# EAGLE design Rev 1 (EAGLE 5.11)
OC_FARNELL: unknown
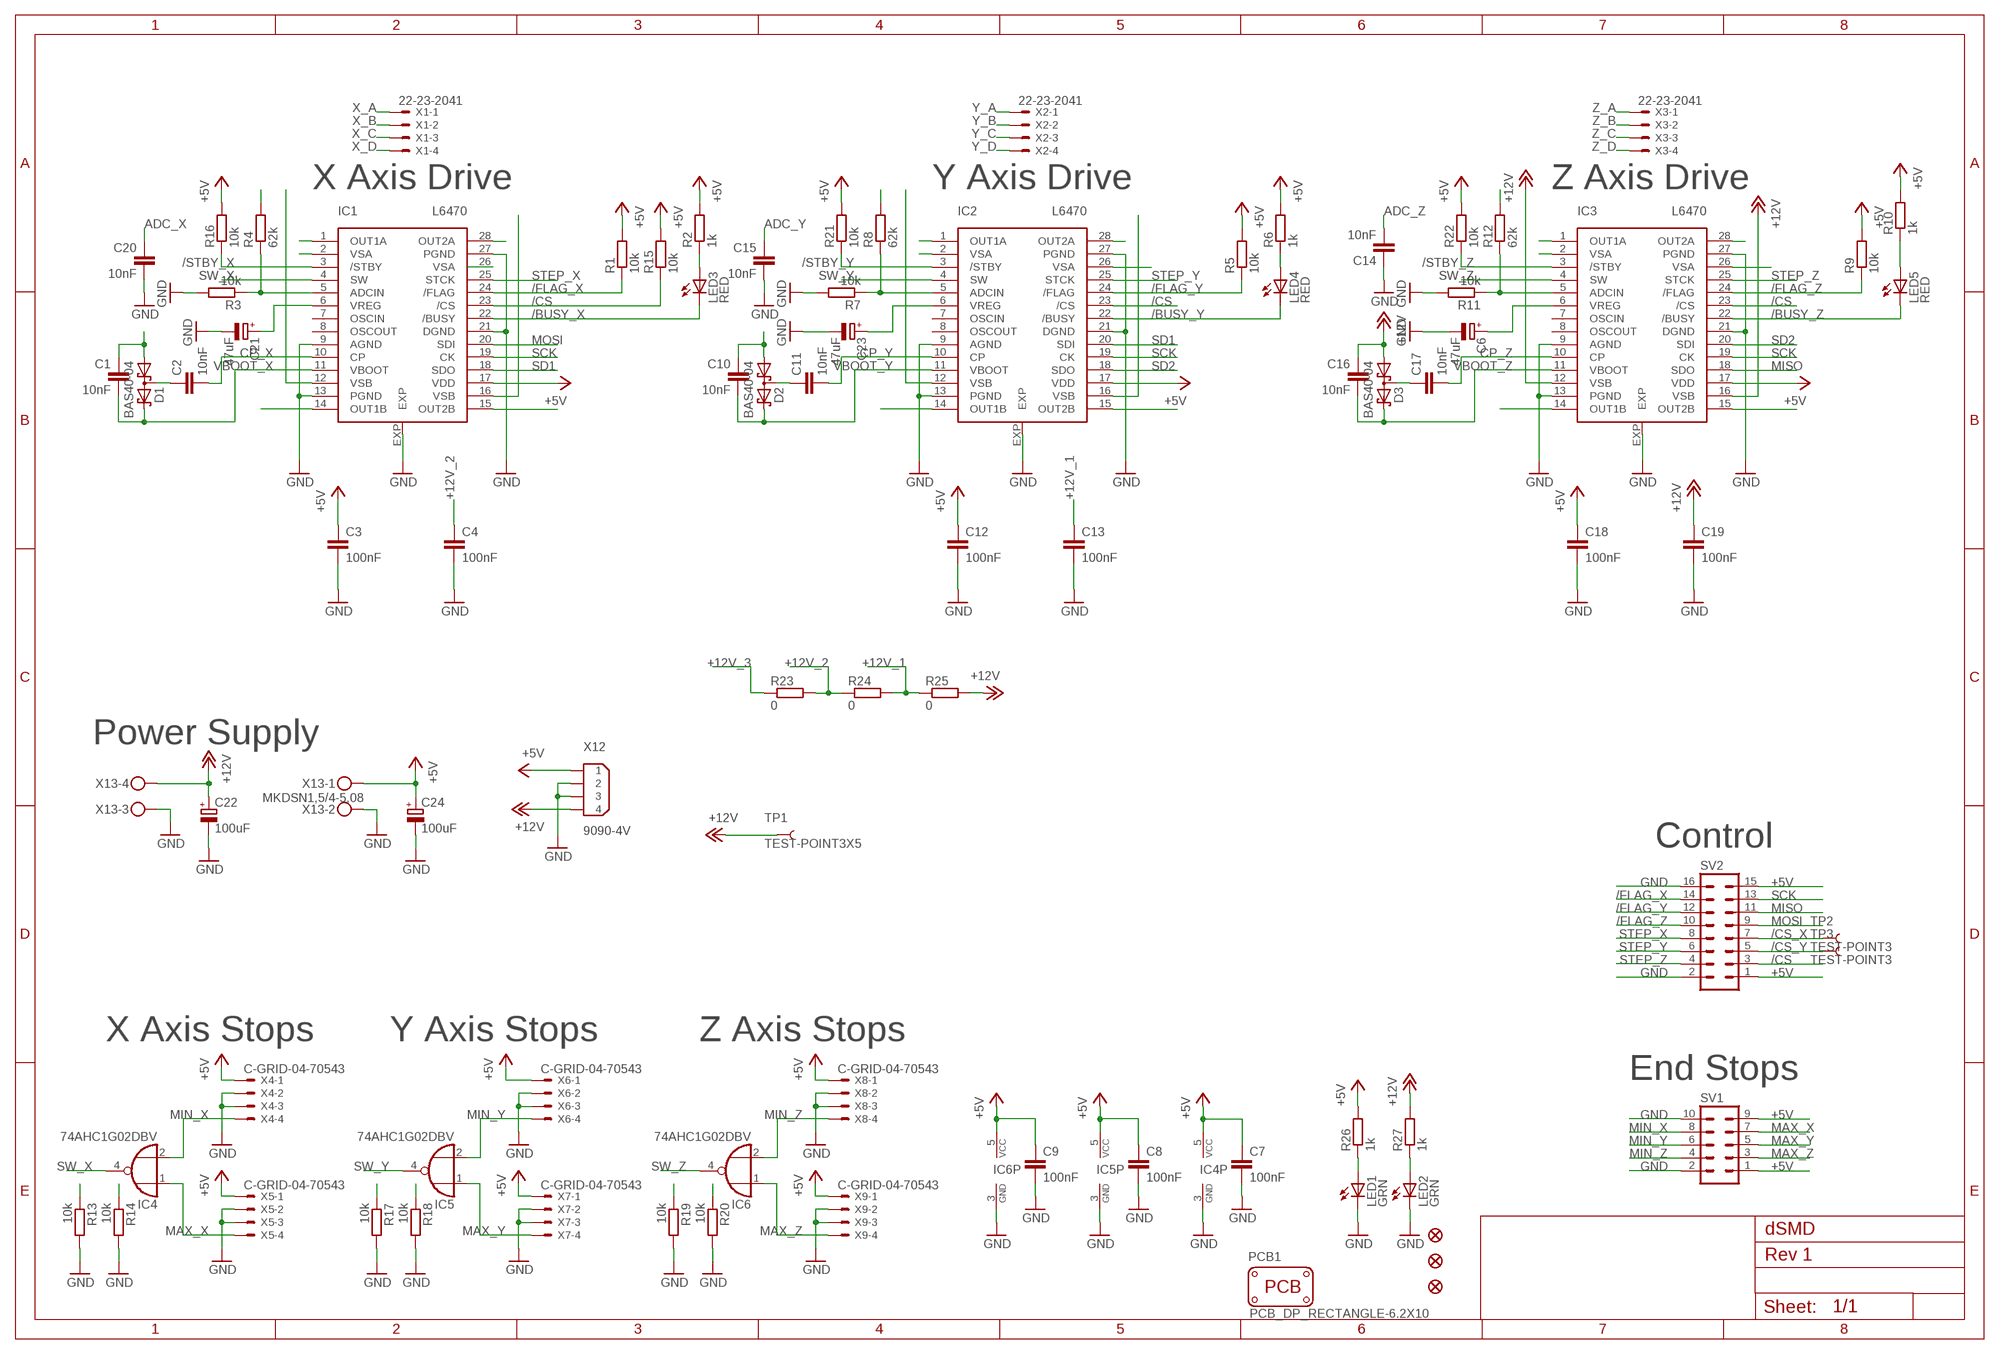
[diagram p0: schematic, sheet 1]

## Parts
C1  10nF  C-EUC0603  [C0603]
C2  10nF  C-EUC0603  [C0603]
C3  100nF  C-EUC0603  [C0603]
C4  100nF  C-EUC0603  [C0603]
C6  47uF  CPOL-EUB  [PANASONIC_B]
C7  100nF  C-EUC0603  [C0603]
C8  100nF  C-EUC0603  [C0603]
C9  100nF  C-EUC0603  [C0603]
C10  10nF  C-EUC0603  [C0603]
C11  10nF  C-EUC0603  [C0603]
C12  100nF  C-EUC0603  [C0603]
C13  100nF  C-EUC0603  [C0603]
C14  10nF  C-EUC0603  [C0603]
C15  10nF  C-EUC0603  [C0603]
C16  10nF  C-EUC0603  [C0603]
C17  10nF  C-EUC0603  [C0603]
C18  100nF  C-EUC0603  [C0603]
C19  100nF  C-EUC0603  [C0603]
C20  10nF  C-EUC0603  [C0603]
C21  47uF  CPOL-EUB  [PANASONIC_B]
C22  100uF  CPOL-EUE  [PANASONIC_E]
C23  47uF  CPOL-EUB  [PANASONIC_B]
C24  100uF  CPOL-EUE  [PANASONIC_E]
D1  BAS40-04  [SOT23]
D2  BAS40-04  [SOT23]
D3  BAS40-04  [SOT23]
FID1  FIDUCIAL1X2.5  [FIDUCIAL-1X2.5]
FID2  FIDUCIAL1X2.5  [FIDUCIAL-1X2.5]
FID3  FIDUCIAL1X2.5  [FIDUCIAL-1X2.5]
IC1  L6470  [TSSOP28]
IC2  L6470  [TSSOP28]
IC3  L6470  [TSSOP28]
IC4  74AHC1G02DBV  [SOT23-5]
IC5  74AHC1G02DBV  [SOT23-5]
IC6  74AHC1G02DBV  [SOT23-5]
LED1  GRN  LEDCHIP-LED0603  [CHIP-LED0603]
LED2  GRN  LEDCHIP-LED0603  [CHIP-LED0603]
LED3  RED  LEDCHIP-LED0603  [CHIP-LED0603]
LED4  RED  LEDCHIP-LED0603  [CHIP-LED0603]
LED5  RED  LEDCHIP-LED0603  [CHIP-LED0603]
PCB1  PCB_DP_RECTANGLE-6.2X10  [DP10062_V1]
R1  10k  R-EU_R0603  [R0603]
R2  1k  R-EU_R0603  [R0603]
R3  10k  R-EU_R0603  [R0603]
R4  62k  R-EU_R0603  [R0603]
R5  10k  R-EU_R0603  [R0603]
R6  1k  R-EU_R0603  [R0603]
R7  10k  R-EU_R0603  [R0603]
R8  62k  R-EU_R0603  [R0603]
R9  10k  R-EU_R0603  [R0603]
R10  1k  R-EU_R0603  [R0603]
R11  10k  R-EU_R0603  [R0603]
R12  62k  R-EU_R0603  [R0603]
R13  10k  R-EU_R0603  [R0603]
R14  10k  R-EU_R0603  [R0603]
R15  10k  R-EU_R0603  [R0603]
R16  10k  R-EU_R0603  [R0603]
R17  10k  R-EU_R0603  [R0603]
R18  10k  R-EU_R0603  [R0603]
R19  10k  R-EU_R0603  [R0603]
R20  10k  R-EU_R0603  [R0603]
R21  10k  R-EU_R0603  [R0603]
R22  10k  R-EU_R0603  [R0603]
R23  0  R-EU_0204/7  [0204/7]
R24  0  R-EU_0204/7  [0204/7]
R25  0  R-EU_0204/7  [0204/7]
R26  1k  R-EU_R0603  [R0603]
R27  1k  R-EU_R0603  [R0603]
SV1  ML10  [ML10]
SV2  ML16  [ML16]
TP1  TEST-POINT3X5  [PAD.03X.05]
TP2  TEST-POINT3  [PAD.03X.03]
TP3  TEST-POINT3  [PAD.03X.03]
X1  22-23-2041  [22-23-2041]
X2  22-23-2041  [22-23-2041]
X3  22-23-2041  [22-23-2041]
X4  C-GRID-04-70543  [70543-04]
X5  C-GRID-04-70543  [70543-04]
X6  C-GRID-04-70543  [70543-04]
X7  C-GRID-04-70543  [70543-04]
X8  C-GRID-04-70543  [70543-04]
X9  C-GRID-04-70543  [70543-04]
X12  9090-4V  [9090-4V]
X13  MKDSN1,5/4-5,08  [MKDSN1,5/4-5,08]

## Nets
+5V [5_V]: C3.1 C7.1 C8.1 C9.1 C12.1 C18.1 C24.+ IC1.17(VDD) IC2.17(VDD) IC3.17(VDD) IC4.5(VCC) IC5.5(VCC) IC6.5(VCC) R1.2 R2.2 R5.2 R6.2 R9.2 R10.2 R15.2 R16.2 R21.2 R22.2 R26.2 SV1.1 SV1.9 SV2.1 SV2.15 X4.1 X5.1 X6.1 X7.1 X8.1 X9.1 X12.1 X13.1
+12V [12_V]: C16.1 C19.1 C22.+ D3.1(A1) IC3.12(VSB) IC3.16(VSB) R25.2 R27.2 TP1.P$1 X12.4 X13.4
+12V_1 [12_V]: C10.1 C13.1 D2.1(A1) IC2.12(VSB) IC2.16(VSB) IC3.2(VSA) IC3.26(VSA) R12.2 R24.2 R25.1
+12V_2: C1.1 C4.1 D1.1(A1) IC1.12(VSB) IC1.16(VSB) IC2.2(VSA) IC2.26(VSA) R8.2 R23.2 R24.1
+12V_3: IC1.2(VSA) IC1.26(VSA) R4.2 R23.1
/BUSY_X: IC1.22(/BUSY) LED3.C
/BUSY_Y: IC2.22(/BUSY) LED4.C
/BUSY_Z: IC3.22(/BUSY) LED5.C
/CS: IC1.23(/CS) IC2.23(/CS) IC3.23(/CS) R15.1 SV2.3
/CS_X: SV2.7 TP2.P$1
/CS_Y: SV2.5 TP3.P$1
/FLAG_X: IC1.24(/FLAG) R1.1 SV2.14
/FLAG_Y: IC2.24(/FLAG) R5.1 SV2.12
/FLAG_Z: IC3.24(/FLAG) R9.1 SV2.10
/STBY_X: IC1.3(/STBY) R16.1
/STBY_Y: IC2.3(/STBY) R21.1
/STBY_Z: IC3.3(/STBY) R22.1
ADC_X: C20.1 IC1.5(ADCIN) R3.1 R4.1
ADC_Y: C15.1 IC2.5(ADCIN) R7.1 R8.1
ADC_Z: C14.2 IC3.5(ADCIN) R11.1 R12.1
CP_X: C2.2 IC1.10(CP)
CP_Y: C11.2 IC2.10(CP)
CP_Z: C17.2 IC3.10(CP)
GND: C3.2 C4.2 C6.- C7.2 C8.2 C9.2 C12.2 C13.2 C14.1 C15.2 C18.2 C19.2 C20.2 C21.- C22.- C23.- C24.- IC1.9(AGND) IC1.13(PGND) IC1.21(DGND) IC1.27(PGND) IC1.EXP IC2.9(AGND) IC2.13(PGND) IC2.21(DGND) IC2.27(PGND) IC2.EXP IC3.9(AGND) IC3.13(PGND) IC3.21(DGND) IC3.27(PGND) IC3.EXP IC4.3(GND) IC5.3(GND) IC6.3(GND) LED1.C LED2.C R3.2 R7.2 R11.2 R13.2 R14.2 R17.2 R18.2 R19.2 R20.2 SV1.2 SV1.10 SV2.2 SV2.16 X4.2 X4.3 X5.2 X5.3 X6.2 X6.3 X7.2 X7.3 X8.2 X8.3 X9.2 X9.3 X12.2 X12.3 X13.2 X13.3
MAX_X: IC4.1(I0) R14.1 SV1.7 X5.4
MAX_Y: IC5.1(I0) R18.1 SV1.5 X7.4
MAX_Z: IC6.1(I0) R20.1 SV1.3 X9.4
MIN_X: IC4.2(I1) R13.1 SV1.8 X4.4
MIN_Y: IC5.2(I1) R17.1 SV1.6 X6.4
MIN_Z: IC6.2(I1) R19.1 SV1.4 X8.4
MISO: IC3.18(SDO) SV2.11
MOSI: IC1.20(SDI) SV2.9
N$1: C17.1 D3.3(C1A2)
N$3: C2.1 D1.3(C1A2)
N$10: C21.+ IC1.6(VREG)
N$15: C11.1 D2.3(C1A2)
N$17: LED1.A R26.1
N$18: LED2.A R27.1
N$22: LED3.A R2.1
N$23: LED4.A R6.1
N$26: LED5.A R10.1
N$27: C6.+ IC3.6(VREG)
N$29: C23.+ IC2.6(VREG)
SCK: IC1.19(CK) IC2.19(CK) IC3.19(CK) SV2.13
SD1: IC1.18(SDO) IC2.20(SDI)
SD2: IC2.18(SDO) IC3.20(SDI)
STEP_X: IC1.25(STCK) SV2.8
STEP_Y: IC2.25(STCK) SV2.6
STEP_Z: IC3.25(STCK) SV2.4
SW_X: IC1.4(SW) IC4.4(O)
SW_Y: IC2.4(SW) IC5.4(O)
SW_Z: IC3.4(SW) IC6.4(O)
VBOOT_X: C1.2 D1.2(C2) IC1.11(VBOOT)
VBOOT_Y: C10.2 D2.2(C2) IC2.11(VBOOT)
VBOOT_Z: C16.2 D3.2(C2) IC3.11(VBOOT)
X_A [12_V]: IC1.14(OUT1B) X1.1
X_B [12_V]: IC1.15(OUT2B) X1.2
X_C [12_V]: IC1.28(OUT2A) X1.3
X_D [12_V]: IC1.1(OUT1A) X1.4
Y_A [12_V]: IC2.14(OUT1B) X2.1
Y_B [12_V]: IC2.15(OUT2B) X2.2
Y_C [12_V]: IC2.28(OUT2A) X2.3
Y_D [12_V]: IC2.1(OUT1A) X2.4
Z_A: IC3.14(OUT1B) X3.1
Z_B: IC3.15(OUT2B) X3.2
Z_C: IC3.28(OUT2A) X3.3
Z_D: IC3.1(OUT1A) X3.4
Unconnected: IC1.7(OSCIN) IC1.8(OSCOUT) IC2.7(OSCIN) IC2.8(OSCOUT) IC3.7(OSCIN) IC3.8(OSCOUT)

## Notes on the sheet
- X Axis Drive | Y Axis Drive | Z Axis Drive
- Power Supply
- Control
- X Axis Stops | Y Axis Stops | Z Axis Stops
- End Stops
- dSMD

## Library data of the parts
C1-C4 C7-C20 = rcl:C-EU: CAPACITOR, European symbol
C6 C21-C24 = rcl:CPOL-EU: POLARIZED CAPACITOR, European symbol
D1-D3 = diode:BAS40-04: Silicon Schottky Diodes General-purpose diode for high-speed switching
FID1-FID3 = microbuilder:FIDUCIAL: Fiducial Alignment Points Various fiducial points for machine vision alignment.
IC1-IC3 = general:L6470: The L6470, realized in analog mixed signal technology, is an advanced fully integrated solution suitable for driving two phase bipolar stepper motors with microstepping. It integrates a dual low RDSon DMOS full bridge with all of the power switches equipped with an accurate on chip current sensing circuitry suitable for non dissipative current control and overcurrent protections. Thanks to a unique control system a true 1/128 steps resolution is achieved. The digital control core can generate user defined motion profiles with acceleration, deceleration, speed or target position easily programmed through a dedicated registers set. All commands and data registers, including those used to set analogue values (i.e. current control value, current protection trip point, dead time, PWM frequency etc.) are sent through a standard 5Mbit/s SPI. A very rich set of protections (thermal, low bus voltage, overcurrent, motor stall) allows designing a fully protected application, as required by most demanding motor control applications.
IC4-IC6 = 74xx-little-de:74*1G02: 2-input NOR gate
LED1-LED5 = led:LED: LED OSRAM: - CHIPLED LG R971, LG N971, LY N971, LG Q971, LY Q971, LO R971, LY R971 LH N974, LH R974 LS Q976, LO Q976, LY Q976 LO Q996 - Hyper CHIPLED LW Q18S LB Q993, LB Q99A, LB R99A - SideLED LS A670, LO A670, LY A670, LG A670, LP A670 LB A673, LV A673, LT A673, LW A673 LH A674 LY A675 LS A676, LA A676, LO A676, LY A676, LW A676 LS A679, LY A679, LG A679 - Hyper Micro SIDELED® LS Y876, LA Y876, LO Y876, LY Y876 LT Y87S - SmartLED LW L88C, LW L88S LB L89C, LB L89S, LG L890 LS L89K, LO L89K, LY L89K LS L896, LA L896, LO L896, LY L896 - TOPLED LS T670, LO T670, LY T670, LG T670, LP T670 LSG T670, LSP T670, LSY T670, LOP T670, LYG T670 LG T671, LOG T671, LSG T671 LB T673, LV T673, LT T673, LW T673 LH T674 LS T676, LA T676, LO T676, LY T676, LB T676, LH T676, LSB T676, LW T676 LB T67C, LV T67C, LT T67C, LS T67K, LO T67K, LY T67K, LW E67C LS E67B, LA E67B, LO E67B, LY E67B, LB E67C, LV E67C, LT E67C LW T67C LS T679, LY T679, LG T679 LS T770, LO T770, LY T770, LG T770, LP T770 LB T773, LV T773, LT T773, LW T773 LH T774 LS E675, LA E675, LY E675, LS T675 LS T776, LA T776, LO T776, LY T776, LB T776 LHGB T686 LT T68C, LB T68C - Hyper Mini TOPLED® LB M676 - Mini TOPLED Santana® LG M470 LS M47K, LO M47K, LY M47K Source: http://www.osram.convergy.de LUXEON: - LUMILED® LXK2-PW12-R00, LXK2-PW12-S00, LXK2-PW14-U00, LXK2-PW14-V00 LXK2-PM12-R00, LXK2-PM12-S00, LXK2-PM14-U00 LXK2-PE12-Q00, LXK2-PE12-R00, LXK2-PE12-S00, LXK2-PE14-T00, LXK2-PE14-U00 LXK2-PB12-K00, LXK2-PB12-L00, LXK2-PB12-M00, LXK2-PB14-N00, LXK2-PB14-P00, LXK2-PB14-Q00 LXK2-PR12-L00, LXK2-PR12-M00, LXK2-PR14-Q00, LXK2-PR14-R00 LXK2-PD12-Q00, LXK2-PD12-R00, LXK2-PD12-S00 LXK2-PH12-R00, LXK2-PH12-S00 LXK2-PL12-P00, LXK2-PL12-Q00, LXK2-PL12-R00 Source: www.luxeon.com KINGBRIGHT: KA-3528ASYC Source: www.kingbright.com
PCB1 = dp_devices:PCB_DP_RECTANGLE: Dangerous Prototypes Standard Rectangular PCB sizes
R1-R27 = rcl:R-EU_: RESISTOR, European symbol
SV1 = con-harting-ml:ML10: HARTING
SV2 = con-ml:ML16: HARTING
TP1-TP3 = SparkFun:TEST-POINT
X1-X3 = con-molex:22-23-2041: .100" (2.54mm) Center Header - 4 Pin
X4-X9 = con-molex:C-GRID-04: CONNECTOR wire to board 2.54 mm (0.100") pitch header
X12 = con-thomas-betts:9090-4: Disk Drive Power four position Source: Thomas & Betts Electronic Interconnects Eiropean Edition 1998
X13 = con-phoenix-508:MKDSN1,5/4-5,08: MKDSN 1,5/ 4-5,08 Printklemme Nennstrom: 13,5 A Nennspannung: 250 V Rastermaß: 5,08 mm Polzahl: 4 Anschlussart: Schraubanschluss Montage: Löten Anschlussrichtung Leiter/Platine: 0 ° Artikelnummer: 1729144 Source: http://eshop.phoenixcontact.com .. 1729144.pdf

## Net classes
0 default: drill 0.33 mm, clearance 0.203 mm
1 12_V: width 0.406 mm, drill 0.33 mm, clearance 0.203 mm
2 5_V: width 0.305 mm, drill 0.33 mm, clearance 0.203 mm

## Board
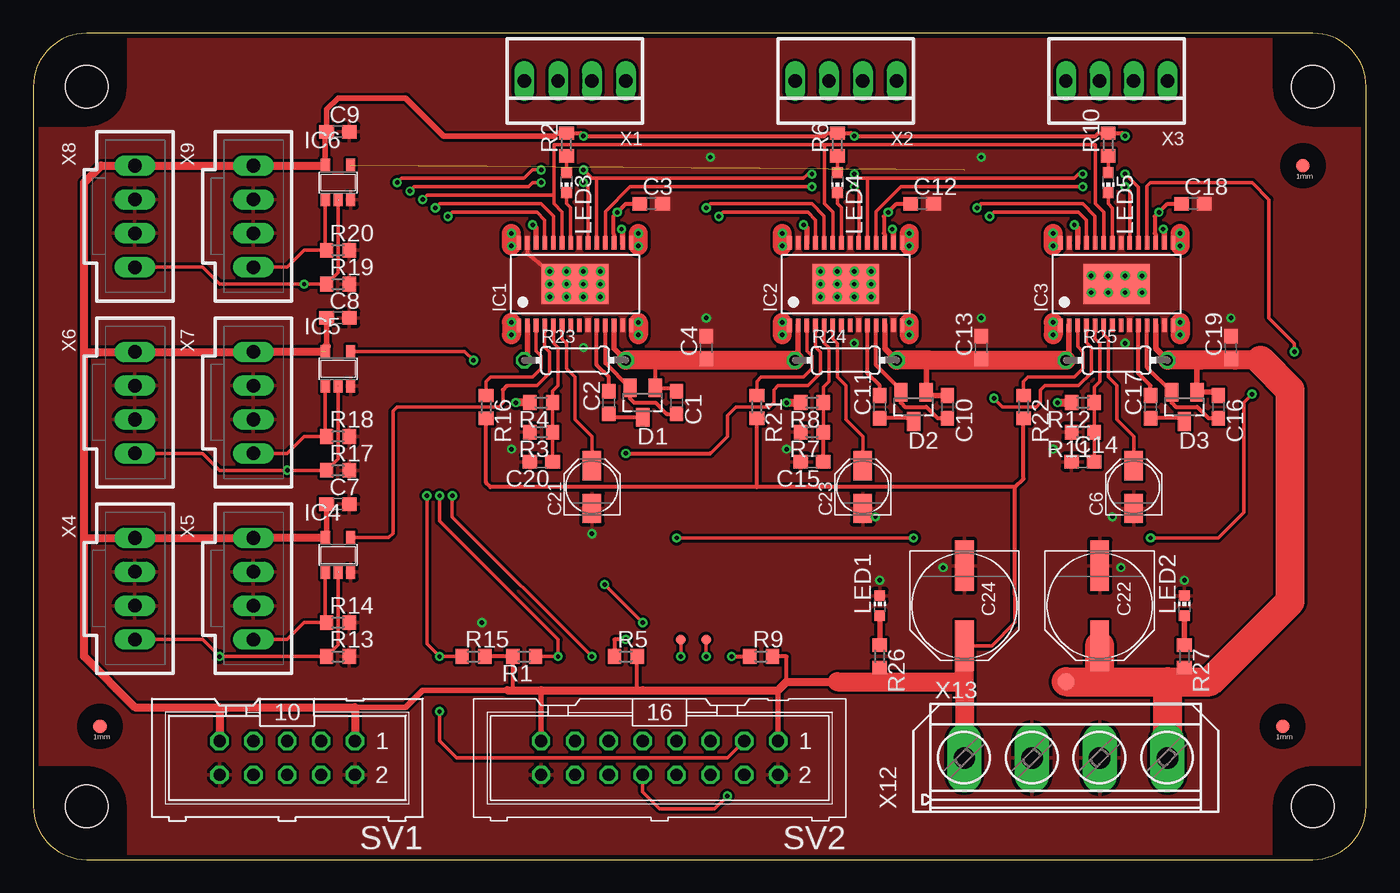
[diagram p1: board, top side]
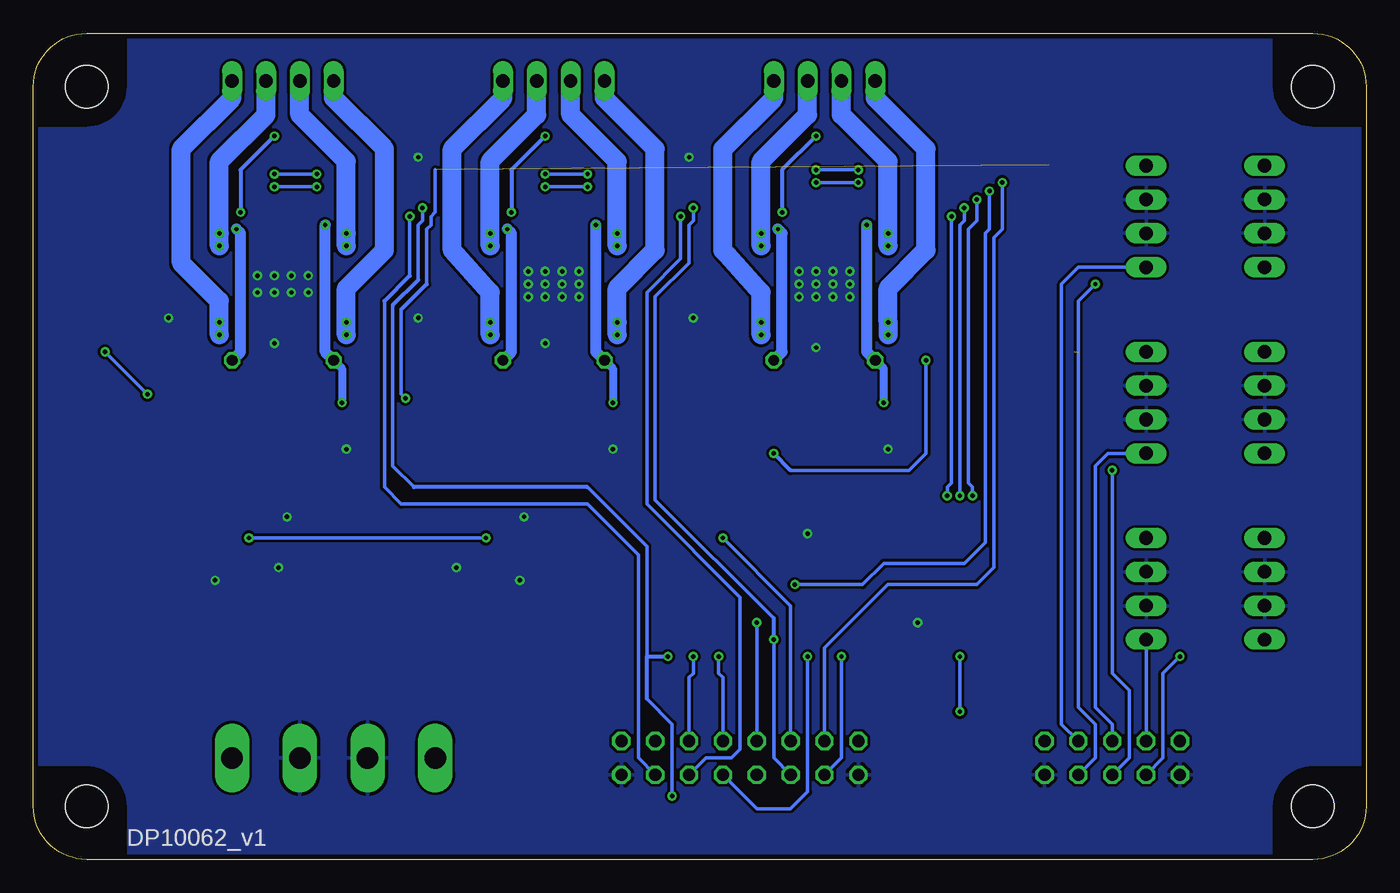
[diagram p2: board, bottom side, seen from below]

Size 100 x 62 mm. Coordinates in mm from the lower left corner, seen from the top.
Copper layers (1*16): Top 0.0356mm / dielectric 1.5011mm / Bottom 0.0356mm
Design rules "LaenPCBOrder": minimum track width 6mil, minimum drill 13mil, track to track 6mil, track to pad 6mil, pad to pad 6mil, via to via 6mil, smd to smd 6mil, copper to edge 15mil, drill to drill 6mil, minimum pad ring 7mil, minimum via ring 7mil, stop-mask expansion 4mil, vias tented up to drill 0mil, thermal gap 10mil

### Footprints (pad centres in the part's own frame; a part is rotated, then mirrored left to right if it is on the bottom)
C0603 = smd 1.1 x 1: 1 -0.85,0; 2 0.85,0
PANASONIC_B = smd 2.2 x 1.4: + 1.6,0; - -1.6,0
PANASONIC_E = smd 3.8 x 1.4: + 3,0; - -3,0
SOT23 = smd 1 x 1.4: 1 -0.95,-1.1; 2 0.95,-1.1; 3 0,1.1
FIDUCIAL-1X2.5 = smd 1 x 1: 1 0,0
TSSOP28 = smd 0.35 x 1: 1 -4.225,-3.087; 2 -3.575,-3.087; 3 -2.925,-3.087; 4 -2.275,-3.087; 5 -1.625,-3.087; 6 -0.975,-3.087; 7 -0.325,-3.087; 8 0.325,-3.087; 9 0.975,-3.087; 10 1.625,-3.087; 11 2.275,-3.087; 12 2.925,-3.087; 13 3.575,-3.087; 14 4.225,-3.087; 15 4.225,3.087; 16 3.575,3.087; 17 2.925,3.087; 18 2.275,3.087; 19 1.625,3.087; 20 0.975,3.087; 21 0.325,3.087; 22 -0.325,3.087; 23 -0.975,3.087; 24 -1.625,3.087; 25 -2.275,3.087; 26 -2.925,3.087; 27 -3.575,3.087; 28 -4.225,3.087 | smd 5 x 3: EXP 0,0
SOT23-5 = smd 0.69 x 0.99: 1 -0.95,-1.29; 2 0,-1.29; 3 0.95,-1.29; 4 0.95,1.3; 5 -0.95,1.3
CHIP-LED0603 = smd 0.8 x 0.8: A 0,-0.75; C 0,0.75
DP10062_V1 = hole 3.2: 4,4; 96,4; 96,58; 4,58
R0603 = smd 1 x 1.1: 1 -0.85,0; 2 0.85,0
0204/7 = drill 0.813 octagon: 1 -3.81,0; 2 3.81,0
ML10 = drill 0.914 octagon: 1 -5.08,-1.27; 2 -5.08,1.27; 3 -2.54,-1.27; 4 -2.54,1.27; 5 0,-1.27; 6 0,1.27; 7 2.54,-1.27; 8 2.54,1.27; 9 5.08,-1.27; 10 5.08,1.27
ML16 = drill 0.914 octagon: 1 -8.89,-1.27; 2 -8.89,1.27; 3 -6.35,-1.27; 4 -6.35,1.27; 5 -3.81,-1.27; 6 -3.81,1.27; 7 -1.27,-1.27; 8 -1.27,1.27; 9 1.27,-1.27; 10 1.27,1.27; 11 3.81,-1.27; 12 3.81,1.27; 13 6.35,-1.27; 14 6.35,1.27; 15 8.89,-1.27; 16 8.89,1.27
PAD.03X.05 = smd 1.27 x 1.27: P$1 0,0
PAD.03X.03 = smd 0.762 x 0.762: P$1 0,0
22-23-2041 = drill 1 long: 1 -3.81,0; 2 -1.27,0; 3 1.27,0; 4 3.81,0
70543-04 = drill 1.016 long: 1 -3.81,0; 2 -1.27,0; 3 1.27,0; 4 3.81,0
9090-4V = drill 1.6 pad 2.6 long: 1 -7.62,0; 2 -2.54,0; 3 2.54,0; 4 7.62,0
MKDSN1,5/4-5,08 = drill 1.3 pad 2 round: 1 -7.641,0.025; 2 -2.561,0.025; 3 2.519,0.025; 4 7.599,0.025

### Placement (x,y rotation side)
C1  48.26,34.29 270 top
C2  43.18,34.29 90 top
C3  46.35,49.21 0 top
C4  50.48,38.42 90 top
C6  82.55,27.94 90 top
C7  22.86,26.67 0 top
C8  22.86,40.64 0 top
C9  22.86,54.61 0 top
C10  68.58,33.97 270 top
C11  63.5,33.97 90 top
C12  66.67,49.21 0 top
C13  71.12,38.42 90 top
C14  78.74,29.84 0 top
C15  58.42,29.84 180 top
C16  88.9,33.97 270 top
C17  83.82,33.97 90 top
C18  87,49.21 0 top
C19  89.85,38.42 90 top
C20  38.1,29.84 180 top
C21  41.91,27.94 90 top
C22  80.01,19.05 270 top
C23  62.23,27.94 90 top
C24  69.85,19.05 270 top
D1  45.72,34.29 180 top
D2  66.04,33.97 180 top
D3  86.36,33.97 180 top
FID1  5,10 0 top
FID2  93.73,10 0 top
FID3  95.25,52.07 0 top
IC1  40.64,43.18 0 top
IC2  60.96,43.18 0 top
IC3  81.28,43.18 0 top
IC4  22.86,22.86 0 top
IC5  22.86,36.83 0 top
IC6  22.86,50.8 0 top
LED1  63.5,19.05 0 top
LED2  86.36,19.05 0 top
LED3  40.01,50.8 180 top
LED4  60.33,50.8 180 top
LED5  80.64,50.8 180 top
PCB1  0,0 0 top
R1  36.83,15.24 180 top
R2  40.01,53.66 90 top
R3  38.1,32.07 180 top
R4  38.1,34.29 180 top
R5  44.45,15.24 0 top
R6  60.33,53.66 90 top
R7  58.42,32.07 180 top
R8  58.42,34.29 180 top
R9  54.61,15.24 0 top
R10  80.64,53.66 90 top
R11  78.74,32.07 180 top
R12  78.74,34.29 180 top
R13  22.86,15.24 0 top
R14  22.86,17.78 0 top
R15  33.02,15.24 0 top
R16  33.97,33.97 270 top
R17  22.86,29.21 0 top
R18  22.86,31.75 0 top
R19  22.86,43.18 0 top
R20  22.86,45.72 0 top
R21  54.29,33.97 270 top
R22  74.3,33.97 270 top
R23  40.64,37.47 0 top
R24  60.96,37.47 0 top
R25  81.28,37.47 0 top
R26  63.5,15.24 270 top
R27  86.36,15.24 270 top
SV1  19.05,7.62 180 top
SV2  46.99,7.62 180 top
TP1  77.47,13.34 0 top
TP2  48.58,16.51 0 top
TP3  50.48,16.51 90 top
X1  40.64,58.42 180 top
X2  60.96,58.42 180 top
X3  81.28,58.42 180 top
X4  7.62,20.32 270 top
X5  16.51,20.32 270 top
X6  7.62,34.29 270 top
X7  16.51,34.29 270 top
X8  7.62,48.26 270 top
X9  16.51,48.26 270 top
X12  77.47,7.62 0 top
X13  77.47,7.62 0 top

### Tracks (layer width: path | path; a pad name or v marks a point on that pad's centre or on a via)
+5V  (via drill 0.33)  (1 unrouted)
  Top 0.254: C24.+ 71.93,16.05 73.66,17.78 73.66,19.86 | X5.1 16.54,24.16 | IC4.5 22.01,24.26
  Top 0.305: R16.2 33.97,28.26 34.29,27.94 54.29,27.94 | 54.29,27.94 R21.2 | R22.2 74.3,28.57 73.66,27.94 | 73.66,27.94 54.29,27.94 | IC1.17 43.56,46.92 43.5,46.99 43.5,48.26 v43.81,48.58 44.45,49.21 C3.1 | IC2.17 63.88,46.92 63.82,46.99 63.82,48.26 v64.14,48.58 64.77,49.21 C12.1 | IC3.17 84.2,46.92 84.14,46.99 84.14,48.26 v84.45,48.58 85.09,49.21 C18.1 | 73.66,19.86 73.66,27.94 | 35.56,12.7 35.98,12.7 R1.2 R15.2 | R5.2 45.3,12.7 45.72,12.7 | R9.2 56.52,15.24 56.52,13.34 | R2.2 41.06,54.51 v41.27,54.29 59.37,54.29 59.59,54.51 R6.2 61.38,54.51 v61.59,54.29 79.69,54.29 79.91,54.51 R10.2 81.7,54.51 v81.92,54.29
  Top 0.406: R2.2 39.27,54.51 39.05,54.29 30.8,54.29 27.94,57.15 22.86,57.15 22.01,56.3 C9.1 21.91,54.61 IC6.5 | 22.01,24.26 C7.1 | 22.01,38.52 C8.1 | 69.85,7.67 X13.1 X12.1 | 55.88,12.7 SV2.1 | 38.1,12.7 SV2.15 | 24.13,11.43 27.94,11.43 29.21,12.7 35.56,12.7
  Top 0.61: 35.56,12.7 38.1,12.7 45.72,12.7 55.88,12.7 56.52,13.34 60.33,13.34 | 16.54,24.16 IC4.5 | X5.1 X4.1 3.81,24.13 | 21.59,38.1 22.01,38.52 | IC5.5 16.54,38.13 X7.1 X6.1 3.81,38.1 | 3.81,24.13 3.81,15.24 7.62,11.43 13.97,11.43 | 3.81,24.13 3.81,38.1 | 3.81,38.1 3.81,50.8 5.08,52.07 X8.1 X9.1 21.88,52.07 IC6.5 | 13.97,11.43 SV1.9 | SV1.1 24.13,11.43 13.97,11.43
  Top 0.813: 63.5,13.34 R26.2
  Top 1.422: 69.85,13.34 C24.+ | 60.33,13.34 63.5,13.34 69.85,13.34 | 69.85,13.34 69.85,7.67
  Bottom 0.305: v43.81,48.58 43.81,51.75 v41.27,54.29 | v64.14,48.58 64.14,51.75 v61.59,54.29 | v84.45,48.58 84.45,51.75 v81.92,54.29
+12V  (via drill 0.33)
  Top 0.305: C19.1 90.07,37.57 90.17,37.47
  Top 0.406: IC3.16 84.86,47.23 v84.77,47.31 | 87.63,37.47 87.31,37.15 D3.1 88.65,35.07 C16.1 | IC3.12 84.2,38.35 R25.2 | 85.09,13.34 85.07,13.31
  Top 0.813: 86.36,13.34 R27.2
  Top 1.422: 92.08,37.47 90.17,37.47 87.63,37.47 R25.2 | X12.4 X13.4
  Top 2.184: 92.08,37.47 94.3,35.24 94.3,19.37 88.27,13.34 86.36,13.34 85.09,13.34 80.01,13.34 | 80.01,13.34 C22.+ | TP1.P$1 80.01,13.34 | 85.07,13.31 X13.4
  Bottom 0.813: v84.77,47.31 84.45,46.99 84.45,38.1 R25.2
+12V_1  (via drill 0.33)
  Top 0.305: 71.12,37.47 C13.1
  Top 0.406: IC2.16 64.53,47.23 v64.45,47.31 | IC3.26 78.36,47.38 v78.11,47.62 | IC3.2 77.7,37.7 R25.1 | IC2.12 63.88,38.35 R24.2 | C10.1 67.24,34.82 D2.1 66.99,37.15 67.31,37.47
  Top 0.61: v76.83,34.29 R12.2
  Top 1.422: R24.2 67.31,37.47 71.12,37.47 R25.1
  Bottom 0.61: R25.1 76.83,36.83 v76.83,34.29
  Bottom 0.813: v78.11,47.62 78.11,38.1 R25.1 | v64.45,47.31 64.14,46.99 64.14,38.1 R24.2
+12V_2  (via drill 0.33)
  Top 0.305: D1.1 48.33,35.39 | 46.67,35.88 46.67,37.47 46.99,37.47 | C4.1 49.43,37.57 49.53,37.47
  Top 0.406: IC2.2 57.38,37.7 R24.1 | v57.78,47.62 58.03,47.38 IC2.26 | IC1.16 44.22,47.23 v44.13,47.31 | IC1.12 43.56,38.35 R23.2 | D1.1 46.67,35.88 | 48.33,35.39 C1.1
  Top 0.61: v56.52,34.29 R8.2
  Top 1.422: R23.2 46.99,37.47 49.53,37.47 R24.1
  Bottom 0.61: R24.1 56.52,36.83 v56.52,34.29
  Bottom 0.813: R24.1 57.78,38.1 v57.78,47.62 | v44.13,47.31 43.81,46.99 43.81,38.1 R23.2
+12V_3  (via drill 0.33)
  Top 0.406: IC1.2 37.06,37.7 R23.1 | IC1.26 37.72,47.38 v37.47,47.62
  Top 0.61: R4.2 v36.2,34.29
  Bottom 0.61: R23.1 36.2,36.83 v36.2,34.29
  Bottom 0.813: v37.47,47.62 37.47,38.1 R23.1
/BUSY_X
  Top 0.254: IC1.22 40.31,48.9 40.01,49.21 LED3.C
/BUSY_Y
  Top 0.254: IC2.22 60.63,48.9 60.33,49.21 LED4.C
/BUSY_Z
  Top 0.254: IC3.22 80.95,48.89 80.64,49.21 LED5.C
/CS  (via drill 0.33)
  Top 0.254: IC1.23 39.66,48.6 39.05,49.21 39.05,49.85 | 39.05,49.85 39.05,53.66 59.37,53.66 | IC2.23 59.98,48.6 59.37,49.21 59.37,53.66 | IC3.23 80.31,48.6 79.69,49.21 79.69,53.66 59.37,53.66 | v29.21,49.53 29.53,49.85 39.05,49.85 | v30.48,11.11 30.48,8.89 31.75,7.62 52.07,7.62 SV2.3 | R15.1 v30.48,15.24 29.53,16.19 v29.53,27.3
  Bottom 0.254: v29.21,49.53 29.21,47.94 29.84,47.31 29.84,28.26 29.53,27.94 v29.53,27.3 | v30.48,11.11 v30.48,15.24
/CS_X  (via drill 0.33)
  Top 0.254: v48.58,15.24 TP2.P$1
  Bottom 0.254: v48.58,15.24 48.58,13.97 48.26,13.65 SV2.7
/CS_Y  (via drill 0.33)
  Top 0.254: v50.48,15.24 TP3.P$1
  Bottom 0.254: v50.48,15.24 50.48,13.97 50.8,13.65 SV2.5
/FLAG_X  (via drill 0.33)
  Top 0.254: IC1.24 39.02,48.3 38.1,49.21 30.48,49.21 v30.16,48.9 | R1.1 v39.37,15.24 39.37,16.51 30.48,25.4 v30.48,27.3
  Bottom 0.254: v30.16,48.9 30.16,47.94 30.48,47.62 v30.48,27.3 | v39.37,15.24 39.37,7.62 SV2.14
/FLAG_Y  (via drill 0.33)
  Top 0.254: IC2.24 59.34,48.3 58.42,49.21 50.8,49.21 v50.48,48.9
  Top 0.305: R5.1 43.6,16.51 v44.45,16.51
  Bottom 0.254: v50.48,48.9 50.48,47.94 50.8,47.62 50.8,44.77 53.34,42.23 53.34,26.99 44.45,18.1 | SV2.12 44.45,7.62 v44.45,16.51
  Bottom 0.305: v44.45,16.51 44.45,18.1
/FLAG_Z  (via drill 0.33)
  Top 0.254: v52.07,4.76 51.12,3.81 46.99,3.81 45.72,5.08 SV2.10 | IC3.24 79.66,48.3 78.74,49.21 71.12,49.21
  Top 0.305: v70.8,48.9 71.12,49.21 | v52.39,15.24 R9.1
  Bottom 0.254: v70.8,48.9 70.8,47.94 71.12,47.62 71.12,43.5 | 73.03,41.59 73.03,29.53 71.44,27.94 | 58.42,27.94 53.98,23.5 53.98,15.24 | v52.07,4.76 52.07,10.16 53.98,12.06
  Bottom 0.305: 73.03,41.59 71.12,43.5 | 53.98,12.06 53.98,15.24 v52.39,15.24 | 58.42,27.94 71.44,27.94
/STBY_X
  Top 0.254: IC1.3 37.72,38.17 38.1,37.78 38.1,36.83 37.47,36.2 34.29,36.2 33.97,35.88 R16.1
/STBY_Y
  Top 0.254: IC2.3 58.03,38.17 58.42,37.78 58.42,36.83 57.78,36.2 54.61,36.2 54.29,35.88 R21.1
/STBY_Z
  Top 0.254: IC3.3 78.36,38.48 78.74,38.1 78.74,36.83 78.11,36.2 74.61,36.2 74.3,35.88 R22.1
ADC_X
  Top 0.254: IC1.5 39.02,38.77 39.37,38.42 39.37,35.56 38.95,35.14 R4.1 R3.1 C20.1
ADC_Y
  Top 0.254: IC2.5 59.34,38.77 59.69,38.42 59.69,35.88 59.27,35.46 R8.1 R7.1
  Top 0.305: C15.1 R7.1
ADC_Z
  Top 0.254: IC3.5 79.66,39.09 80.01,38.73 80.01,35.88 79.59,35.46 R12.1 R11.1 C14.2
CP_X
  Top 0.305: IC1.10 42.27,37.11 43.18,36.2 C2.2
CP_Y
  Top 0.305: IC2.10 62.59,36.48 63.5,35.56 C11.2
CP_Z
  Top 0.305: IC3.10 82.91,36.48 83.82,35.56 C17.2
GND  (via drill 0.33)
  Top 0.305: IC1.27 37.06,45.48 v38.73,44.13
  other vias: 62.87,44.13 61.59,44.13 59.05,44.13 60.33,44.13 60.33,42.23 61.59,42.23 62.87,42.23 59.05,42.23 40.01,44.13 41.27,44.13 42.55,44.13 41.27,42.23 42.55,42.23 40.01,42.23 38.73,42.23 81.92,42.55 80.64,43.81 81.92,43.81 80.64,42.55 79.38,42.55 79.38,43.81 83.19,42.55 83.19,43.81 41.27,43.18 42.55,43.18 40.01,43.18 38.73,43.18 59.05,43.18 60.33,43.18 61.59,43.18 62.87,43.18 41.27,38.42 50.48,40.64 76.52,30.8 81.92,38.73 71.12,40.64 89.85,40.64 61.59,38.73 56.52,30.8 35.88,30.8 41.91,24.45 63.5,20.95 68.26,21.91 81.6,21.91 86.36,20.95 50.8,52.7 71.12,52.7 33.66,17.78 63.18,25.72 80.96,25.72
  pour Bottom (rank 6): 0,62 100,62 100,0 0,0
  pour Top (rank 6): 0,0 100,0 100,62 0,62
  pour Top (rank 5, no thermals): 31.75,50.8 91.44,50.8 91.44,34.29 31.75,34.29
MAX_X
  Top 0.254: X5.4 19.05,16.51 20.32,17.78 R14.1 21.91,17.88 IC4.1
  Bottom 0.254: SV1.7 X5.4
MAX_Y
  Top 0.254: X7.4 19.05,30.48 20.32,31.75 R18.1 21.91,31.85 IC5.1
  Bottom 0.254: SV1.5 19.05,10.16 20.32,11.43 20.32,29.53 19.37,30.48 X7.4
MAX_Z
  Top 0.254: X9.4 19.05,44.45 20.32,45.72 R20.1 21.91,45.82 IC6.1
  Bottom 0.254: SV1.3 22.86,10.16 22.86,43.18 21.59,44.45 X9.4
MIN_X  (via drill 0.33)
  Top 0.254: IC4.2 22.86,16.09 R13.1 v13.97,15.24 12.7,16.51 X4.4
  Bottom 0.254: SV1.8 15.24,7.62 15.24,13.97 v13.97,15.24
MIN_Y  (via drill 0.33)
  Top 0.254: IC5.2 22.86,30.06 R17.1 v19.05,29.21 13.97,29.21 12.7,30.48 X6.4
  Bottom 0.254: SV1.6 17.78,7.62 17.78,12.7 19.05,13.97 v19.05,29.21
MIN_Z  (via drill 0.33)
  Top 0.254: IC6.2 22.86,44.03 R19.1 v20.32,43.18 13.97,43.18 12.7,44.45 X8.4
  Bottom 0.254: SV1.4 20.32,7.62 20.32,10.16 21.59,11.43 21.59,41.91 v20.32,43.18
MISO  (via drill 0.33)
  Top 0.254: IC3.18 83.56,50.53 83.82,50.8 91.44,50.8 92.71,49.53 92.71,40.64 94.61,38.73 v94.61,38.1 | v91.44,34.92 90.81,34.29 90.81,26.04 88.9,24.13 v83.82,24.13 | v48.26,24.13 v66.04,24.13
  Bottom 0.254: v91.44,34.92 v94.61,38.1 | v66.04,24.13 v83.82,24.13 | v48.26,24.13 43.18,19.05 SV2.11
MOSI  (via drill 0.33)
  Top 0.254: v42.86,20.64 v45.72,17.78 | IC1.20 41.62,50.46 v41.27,50.8 | v38.1,50.8 37.47,50.8 37.15,50.48 28.57,50.48 v28.26,50.16
  Bottom 0.254: v38.1,50.8 v41.27,50.8 | v28.26,50.16 28.26,47.31 28.57,46.99 28.57,23.81 30.16,22.23 36.2,22.23 37.78,20.64 v42.86,20.64 | v45.72,17.78 SV2.9
N$1
  Top 0.305: C17.1 86.11,33.12 D3.3
N$3
  Top 0.305: 43.11,33.19 D1.3
  Top 0.406: 43.11,33.19 C2.1
N$10
  Top 0.254: IC1.6 39.66,39.08 40.01,38.73 40.01,36.83 40.64,36.2 40.64,33.02 41.91,31.75 C21.+
N$15
  Top 0.305: C11.1 65.79,33.12 D2.3
N$17
  Top 0.406: R26.1 LED1.A
N$18
  Top 0.406: R27.1 LED2.A
N$22
  Top 0.254: LED3.A R2.1
N$23
  Top 0.254: LED4.A R6.1
N$26
  Top 0.254: R10.1 LED5.A
N$27
  Top 0.254: IC3.6 80.31,39.39 80.64,39.05 80.64,36.2 81.28,35.56 81.28,33.02 82.55,31.75 C6.+
N$29
  Top 0.254: IC2.6 59.98,39.08 60.33,38.73 60.33,36.2 60.96,35.56 60.96,33.02 62.23,31.75 C23.+
SCK  (via drill 0.33)
  Top 0.254: IC3.19 82.91,50.45 v81.92,51.44 | v58.42,51.44 58.1,51.44 57.78,51.12 42.27,51.12 | v78.74,51.44 78.42,51.44 78.11,51.12 62.59,51.12 | 42.27,51.12 IC1.19 | v41.27,51.75 41.91,51.12 42.27,51.12 | v38.1,51.75 37.47,51.75 36.83,51.12 27.62,51.12 v27.3,50.8 | v61.59,51.44 61.91,51.12 62.59,51.12 | 62.59,51.12 IC2.19
  Bottom 0.254: v78.74,51.44 v81.92,51.44 | v58.42,51.44 v61.59,51.44 | v38.1,51.75 v41.27,51.75 | v27.3,50.8 27.3,47.31 27.94,46.67 27.94,21.91 29.21,20.64 35.88,20.64 40.64,15.88 SV2.13
SD1  (via drill 0.33)
  Top 0.254: IC1.18 42.91,48.63 44.77,50.48 v58.42,50.48 | v61.59,50.48 61.94,50.14 IC2.20
  Bottom 0.254: v58.42,50.48 v61.59,50.48
SD2  (via drill 0.33)
  Top 0.254: IC2.18 63.23,48.63 65.09,50.48 v78.74,50.48 | IC3.20 82.25,50.14 v81.92,50.48
  Bottom 0.254: v78.74,50.48 v81.92,50.48
STEP_X  (via drill 0.33)
  Top 0.254: IC1.25 38.37,47.99 37.78,48.58 31.43,48.58 v31.11,48.26 | v31.43,27.3 31.43,25.72 v41.91,15.24
  Bottom 0.254: v31.43,27.3 31.43,27.94 31.11,28.26 v31.11,48.26 | SV2.8 45.72,3.81 43.18,3.81 41.91,5.08 v41.91,15.24
STEP_Y  (via drill 0.33)
  Top 0.254: IC2.25 58.69,47.99 58.1,48.58 51.75,48.58 v51.44,48.26
  Bottom 0.254: v51.44,48.26 51.44,45.09 53.98,42.55 53.98,26.67 46.99,19.68 46.99,8.26 47.62,7.62 49.53,7.62 SV2.6
STEP_Z  (via drill 0.33)
  Top 0.254: IC3.25 79,47.99 78.42,48.58 72.07,48.58 v71.75,48.26
  Bottom 0.254: 71.75,43.81 v71.75,48.26 | 73.66,41.91 73.66,27.94 72.39,26.67 58.42,26.67 54.61,22.86 54.61,7.62 SV2.4
  Bottom 0.305: 73.66,41.91 71.75,43.81
SW_X
  Top 0.254: IC1.4 38.37,38.47 38.73,38.1 38.73,36.51 37.78,35.56 35.56,35.56 | 35.24,35.24 35.24,34.29 34.92,33.97 27.3,33.97 26.99,33.66 26.99,24.48 26.67,24.16 IC4.4
  Top 0.305: 35.24,35.24 35.56,35.56
SW_Y  (via drill 0.33)
  Top 0.254: IC2.4 58.69,38.47 59.05,38.1 59.05,36.51 58.1,35.56 55.88,35.56 55.56,35.24 55.56,34.29 55.24,33.97 52.7,33.97 52.07,33.34 52.07,31.75 50.8,30.48 | IC5.4 32.35,38.13 v33.02,37.47
  Top 0.305: v44.45,30.48 50.8,30.48
  Bottom 0.254: v33.02,37.47 33.02,30.48 34.29,29.21 43.18,29.21
  Bottom 0.305: 43.18,29.21 v44.45,30.48
SW_Z  (via drill 0.33)  (1 unrouted)
  Top 0.254: IC3.4 79,38.79 79.38,38.42 79.38,36.51 78.42,35.56 75.88,35.56 75.56,35.24 75.56,34.29 75.25,33.97 72.71,33.97 v72.07,34.61
  Bottom 0.254: v72.07,34.61 72.39,34.92 72.39,41.27 | 70.48,43.18 70.48,47.31 70.17,47.62 70.17,48.26 69.85,48.58 69.85,51.75
  Bottom 0.305: 72.39,41.27 70.48,43.18
VBOOT_X
  Top 0.305: IC1.11 42.91,37.24 D1.2 44.77,34.61 45.09,34.29 46.67,34.29 47.52,33.44 C1.2
VBOOT_Y
  Top 0.305: IC2.11 63.23,37.09 65.09,35.24 D2.2 | C10.2 67.84,33.12 66.99,33.97 65.41,33.97 65.09,34.29 D2.2 | D2.2
VBOOT_Z
  Top 0.305: C16.2 88.16,33.12 87.31,33.97 85.72,33.97 85.41,34.29 D3.2 83.56,36.93 IC3.11
X_A  (via drill 0.33)
  Top 0.305: IC1.14 45.17,40.09 v45.4,40.32
  Top 1.422: v45.4,40.32 v45.4,39.37
  Bottom 1.422: X1.1 44.45,57.15 48.26,53.34 48.26,45.72 45.4,42.55 v45.4,39.37
X_B  (via drill 0.33)
  Top 0.305: IC1.15 45.17,46.27 v45.4,46.04
  Top 1.422: v45.4,46.04 v45.4,46.99
  Bottom 1.422: X1.2 41.91,55.88 45.4,52.39 v45.4,46.04
X_C  (via drill 0.33)
  Top 0.305: IC1.28 36.11,46.27 v35.88,46.04
  Top 1.422: v35.88,46.04 v35.88,46.99
  Bottom 1.422: X1.3 39.37,55.88 35.88,52.39 v35.88,46.04
X_D  (via drill 0.33)
  Top 0.305: IC1.1 36.41,40.1 v35.88,40.32
  Top 1.422: v35.88,40.32 v35.88,39.37
  Bottom 1.422: v35.88,39.37 v35.88,40.32 35.88,42.86 33.02,45.72 33.02,53.34 36.83,57.15 X1.4
Y_A  (via drill 0.33)
  Top 0.305: IC2.14 65.32,40.09 v65.72,39.37
  Top 1.422: v65.72,39.37 v65.72,40.32
  Bottom 1.422: X2.1 64.77,57.15 68.58,53.34 68.58,45.72 65.72,42.55 v65.72,39.37
Y_B  (via drill 0.33)
  Top 0.305: IC2.15 65.19,46.26 v65.72,46.04
  Top 1.422: v65.72,46.04 v65.72,46.99
  Bottom 1.422: X2.2 62.23,55.88 65.72,52.39 v65.72,46.04
Y_C  (via drill 0.33)
  Top 0.305: IC2.28 56.73,46.26 v56.2,46.04
  Top 1.422: v56.2,46.04 v56.2,46.99
  Bottom 1.422: X2.3 59.69,55.88 56.2,52.39 v56.2,46.04
Y_D  (via drill 0.33)
  Top 0.305: IC2.1 56.6,40.09 v56.2,39.37
  Top 1.422: v56.2,39.37 v56.2,40.32
  Bottom 1.422: X2.4 57.15,57.15 53.34,53.34 53.34,45.72 56.2,42.86 v56.2,40.32 v56.2,39.37
Z_A  (via drill 0.33)
  Top 0.305: IC3.14 86.04,40.09 v86.04,40.32
  Top 1.422: v86.04,40.32 v86.04,39.37
  Bottom 1.422: X3.1 85.09,57.15 88.9,53.34 88.9,44.77 86.04,41.91 v86.04,39.37
Z_B  (via drill 0.33)
  Top 0.305: IC3.15 85.81,46.27 v86.04,46.04
  Top 1.422: v86.04,46.04 v86.04,46.99
  Bottom 1.422: X3.2 82.55,55.88 86.04,52.39 v86.04,46.99 v86.04,46.04
Z_C  (via drill 0.33)
  Top 0.305: IC3.28 76.75,46.27 v76.52,46.04
  Top 1.422: v76.52,46.04 v76.52,46.99
  Bottom 1.422: X3.3 80.01,55.88 76.52,52.39 v76.52,46.99 v76.52,46.04
Z_D  (via drill 0.33)
  Top 0.305: IC3.1 76.75,40.09 v76.52,40.32
  Top 1.422: v76.52,40.32 v76.52,39.37
  Bottom 1.422: X3.4 77.47,57.15 73.66,53.34 73.66,45.72 76.52,42.86 v76.52,39.37